# EAGLE design scanner (EAGLE 7.5.0)
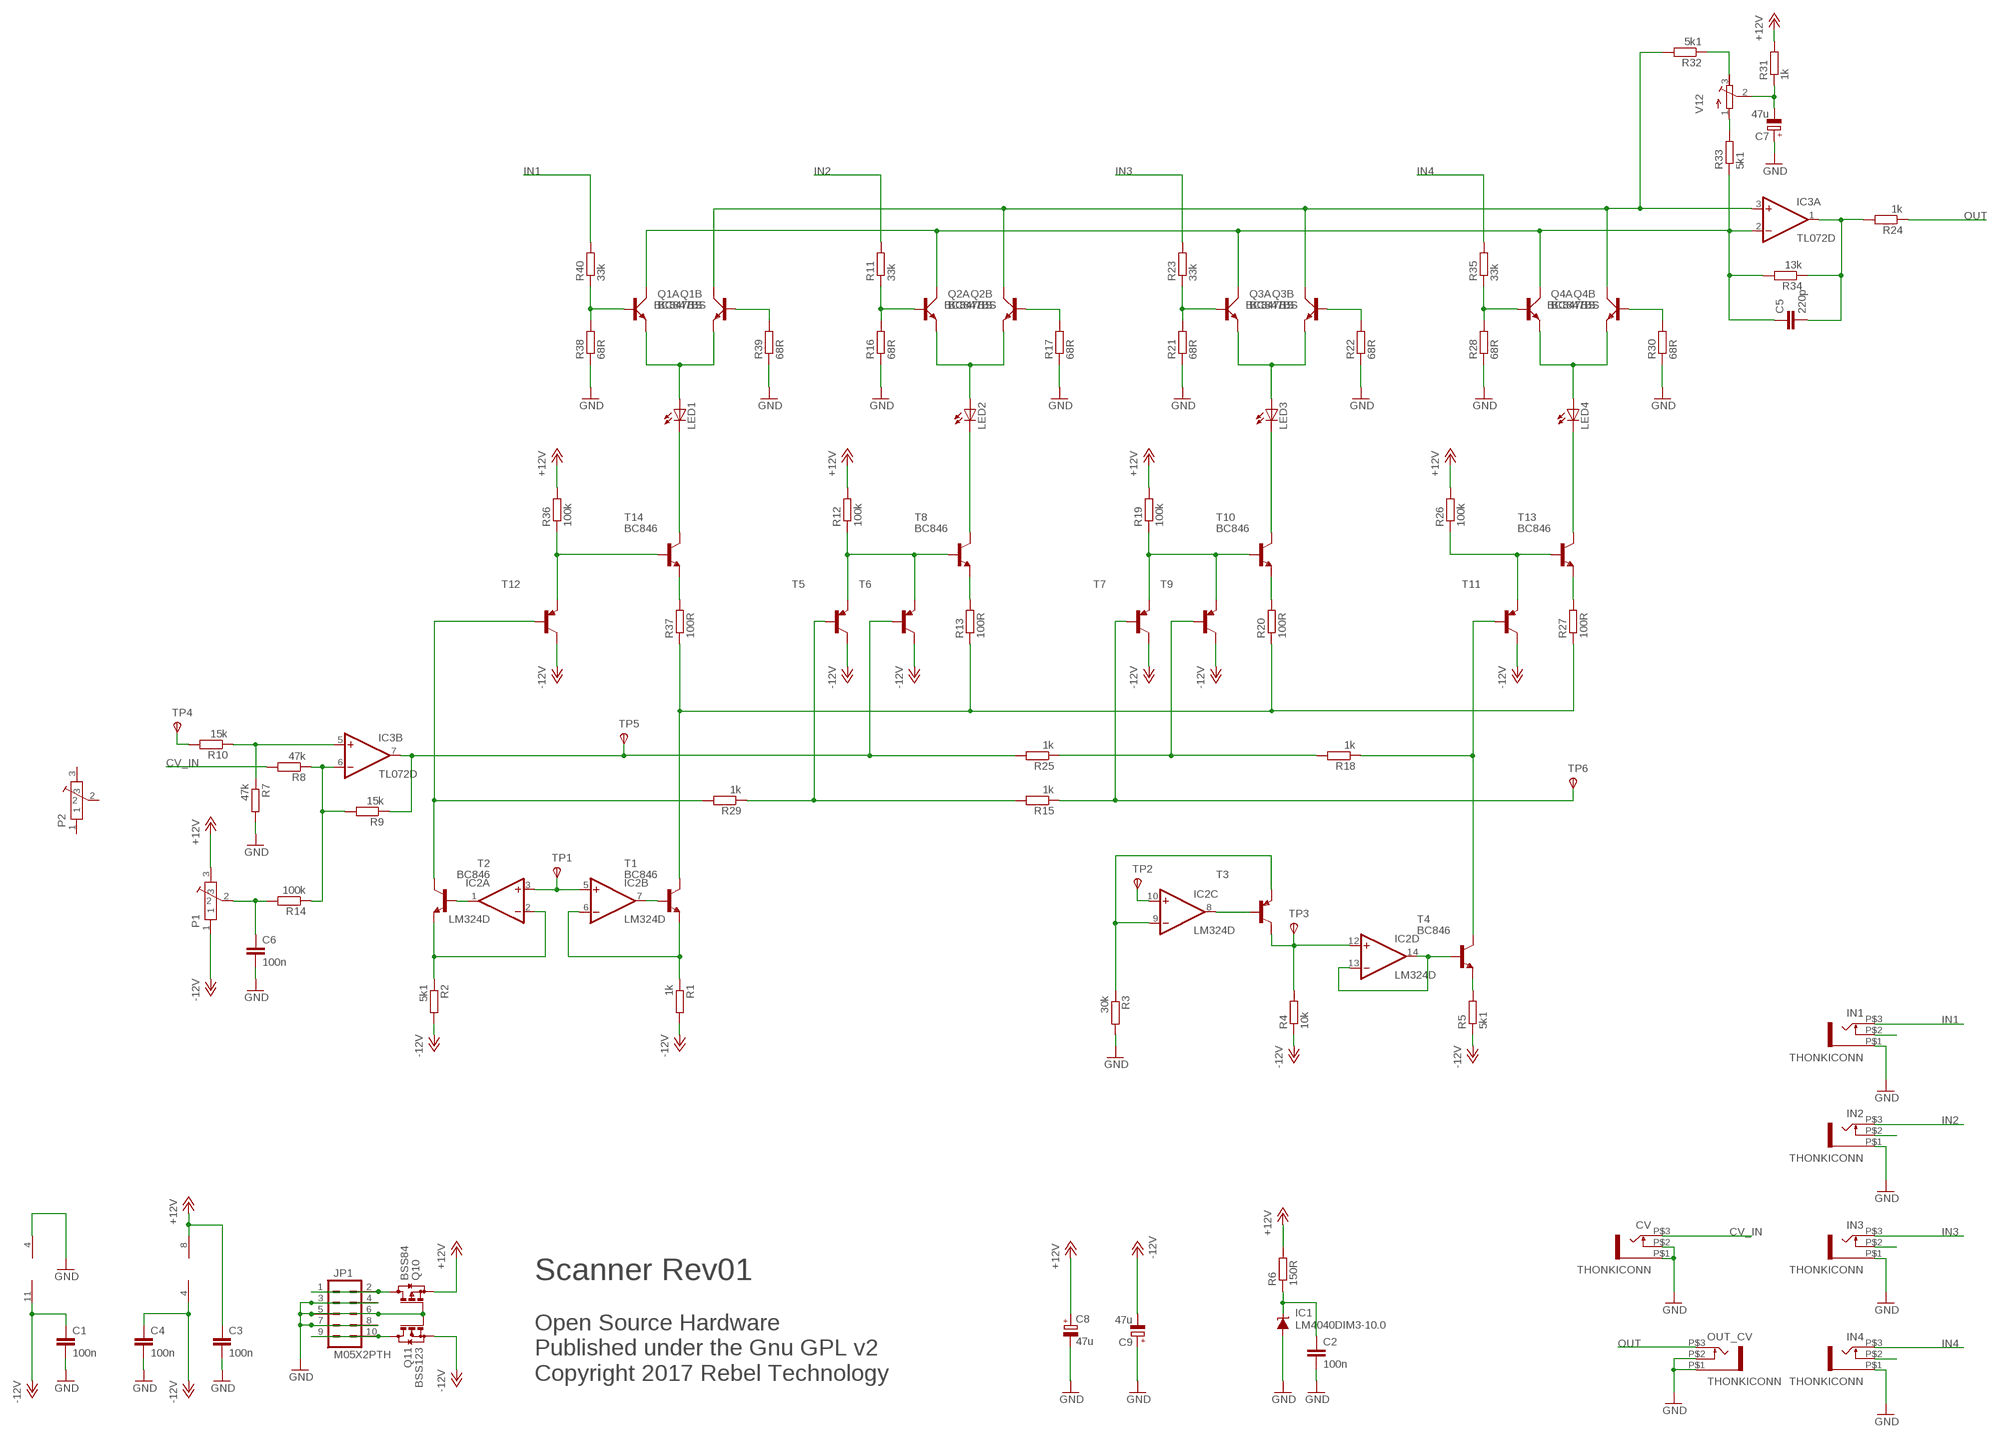
[diagram p0: schematic, sheet 1]

## Parts
C1  100n  C-EUC0603  [C0603]
C2  100n  C-EUC0603  [C0603]
C3  100n  C-EUC0603  [C0603]
C4  100n  C-EUC0603  [C0603]
C5  220p  C-EUC0603  [C0603]
C6  100n  C-EUC0603  [C0603]
C7  47u  CPOL-EU153CLV-0505  [CPOL-5]
C8  47u  CPOL-EU153CLV-0505  [CPOL-5]
C9  47u  CPOL-EU153CLV-0505  [CPOL-5]
CV  THONKICONN  [THONKICONN]
IC1  LM4040DIM3-10.0  LM4041A12DBZ  [DBZ_R-PDSO-G3]
IC2  LM324D  [SO14]
IC3  TL072D  [SO08]
IN1  THONKICONN  [THONKICONN]
IN2  THONKICONN  [THONKICONN]
IN3  THONKICONN  [THONKICONN]
IN4  THONKICONN  [THONKICONN]
JP1  M05X2PTH  [AVR_ICSP]
LED1  LED3MM  [LED3MM]
LED2  LED3MM  [LED3MM]
LED3  LED3MM  [LED3MM]
LED4  LED3MM  [LED3MM]
OUT_CV  THONKICONN  [THONKICONN]
P1  POT-ALPS-RK09L1140  [POT-ALPS-RK09L1140]
P2  POT-ALPS-RK09L1140  [POT-ALPS-RK09L1140]
Q1  BC847BS  [SOT363_PHILIPS]
Q2  BC847BS  [SOT363_PHILIPS]
Q3  BC847BS  [SOT363_PHILIPS]
Q4  BC847BS  [SOT363_PHILIPS]
Q10  BSS84  [SOT23]
Q11  BSS123  [SOT23]
R1  1k  R-EU_0603  [0603]
R2  5k1  R-EU_0603  [0603]
R3  30k  R-EU_0603  [0603]
R4  10k  R-EU_0603  [0603]
R5  5k1  R-EU_0603  [0603]
R6  150R  R-EU_0603  [0603]
R7  47k  R-EU_0603  [0603]
R8  47k  R-EU_0603  [0603]
R9  15k  R-EU_0603  [0603]
R10  15k  R-EU_0603  [0603]
R11  33k  R-EU_0603  [0603]
R12  100k  R-EU_0603  [0603]
R13  100R  R-EU_0603  [0603]
R14  100k  R-EU_0603  [0603]
R15  1k  R-EU_0603  [0603]
R16  68R  R-EU_0603  [0603]
R17  68R  R-EU_0603  [0603]
R18  1k  R-EU_0603  [0603]
R19  100k  R-EU_0603  [0603]
R20  100R  R-EU_0603  [0603]
R21  68R  R-EU_0603  [0603]
R22  68R  R-EU_0603  [0603]
R23  33k  R-EU_0603  [0603]
R24  1k  R-EU_0603  [0603]
R25  1k  R-EU_0603  [0603]
R26  100k  R-EU_0603  [0603]
R27  100R  R-EU_0603  [0603]
R28  68R  R-EU_0603  [0603]
R29  1k  R-EU_0603  [0603]
R30  68R  R-EU_0603  [0603]
R31  1k  R-EU_0603  [0603]
R32  5k1  R-EU_0603  [0603]
R33  5k1  R-EU_0603  [0603]
R34  13k  R-EU_0603  [0603]
R35  33k  R-EU_0603  [0603]
R36  100k  R-EU_0603  [0603]
R37  100R  R-EU_0603  [0603]
R38  68R  R-EU_0603  [0603]
R39  68R  R-EU_0603  [0603]
R40  33k  R-EU_0603  [0603]
T1  BC846  [SOT23]
T2  BC846  [SOT23]
T3  BC856A-PNP-SOT23-BEC  [SOT23-BEC]
T4  BC846  [SOT23]
T5  BC856A-PNP-SOT23-BEC  [SOT23-BEC]
T6  BC856A-PNP-SOT23-BEC  [SOT23-BEC]
T7  BC856A-PNP-SOT23-BEC  [SOT23-BEC]
T8  BC846  [SOT23]
T9  BC856A-PNP-SOT23-BEC  [SOT23-BEC]
T10  BC846  [SOT23]
T11  BC856A-PNP-SOT23-BEC  [SOT23-BEC]
T12  BC856A-PNP-SOT23-BEC  [SOT23-BEC]
T13  BC846  [SOT23]
T14  BC846  [SOT23]
TP1  TPSPAD1-13  [P1-13]
TP2  TPSPAD1-13  [P1-13]
TP3  TPSPAD1-13  [P1-13]
TP4  TPSPAD1-13  [P1-13]
TP5  TPSPAD1-13  [P1-13]
TP6  TPSPAD1-13  [P1-13]
V12  R-TRIMM64W  [RTRIM64W]

## Nets
+12V: C3.1 C8.+ IC3.8(P:V+) P1.3 Q10.2(S) R6.2 R12.2 R19.2 R26.2 R31.2 R36.2
-12V: C1.1 C4.1 C9.- IC2.11(P:V-) IC3.4(P:V-) P1.1 Q11.2(S) R1.2 R2.2 R4.1 R5.1 T5.C T6.C T7.C T9.C T11.C T12.C
CV_IN: CV.P$3 R8.2
GND: C1.2 C2.2 C3.2 C4.2 C6.2 C7.+ C8.- C9.+ CV.P$1 CV.P$2 IC1.2(A) IC2.4(P:V+) IN1.P$1 IN2.P$1 IN3.P$1 IN4.P$1 JP1.3 JP1.4 JP1.5 JP1.6 JP1.7 JP1.8 OUT_CV.P$1 OUT_CV.P$2 Q10.1(G) Q11.1(G) R3.2 R7.2 R16.1 R17.1 R21.1 R22.1 R28.1 R30.1 R38.1 R39.1
IN1: IN1.P$3 R40.2
IN2: IN2.P$3 R11.2
IN3: IN3.P$3 R23.2
IN4: IN4.P$3 R35.2
N$1: IN3.P$2
N$2: IN1.P$2
N$3: IN2.P$2
N$4: JP1.9 JP1.10 Q11.3(D)
N$5: C6.1 P1.2 R14.2
N$6: IN4.P$2
N$7: Q3.2(A:B) R21.2 R23.1
N$8: Q3.5(B:B) R22.2
N$9: LED3.A Q3.1(A:E) Q3.4(B:E)
N$10: R19.1 T7.E T9.E T10.1(B)
N$11: LED3.K(C) T10.3(C)
N$12: R20.2 T10.2(E)
N$13: R18.1 T4.3(C) T11.B
N$15: R15.1 T7.B TP6.TP(PP)
N$17: C5.1 IC3.2(A:-IN) Q1.6(A:C) Q2.6(A:C) Q3.6(A:C) Q4.6(A:C) R33.1 R34.2
N$18: R18.2 R25.1 T9.B
N$20: R13.1 R20.1 R27.1 R37.1 T1.3(C)
N$27: IC2.13(D:-IN) IC2.14(D:OUT) T4.1(B)
N$31: IC2.8(C:OUT) T3.B
N$36: IC2.12(D:+IN) R4.2 T3.C TP3.TP(PP)
N$40: R5.2 T4.2(E)
N$41: IC2.9(C:-IN) R3.1 T3.E
N$42: IC2.10(C:+IN) TP2.TP(PP)
N$47: IC2.1(A:OUT) T2.1(B)
N$51: IC2.7(B:OUT) T1.1(B)
N$53: IC2.3(A:+IN) IC2.5(B:+IN) TP1.TP(PP)
N$58: IC2.6(B:-IN) R1.1 T1.2(E)
N$59: IC2.2(A:-IN) R2.1 T2.2(E)
N$60: IC3.6(B:-IN) R8.1 R9.2 R14.1
N$61: R10.2 TP4.TP(PP)
N$63: IC3.5(B:+IN) R7.1 R10.1
N$79: JP1.1 JP1.2 Q10.3(D)
N$95: C2.1 IC1.1(C) R6.1
N$145: C5.2 IC3.1(A:OUT) R24.2 R34.1
N$147: R33.2 V12.1(A)
N$148: R32.1 V12.3(E)
N$149: C7.- R31.1 V12.2(S)
N$151: Q4.2(A:B) R28.2 R35.1
N$152: Q4.5(B:B) R30.2
N$153: LED4.A Q4.1(A:E) Q4.4(B:E)
N$154: R26.1 T11.E T13.1(B)
N$155: LED4.K(C) T13.3(C)
N$156: R27.2 T13.2(E)
N$158: R29.2 T2.3(C) T12.B
N$159: IC3.7(B:OUT) R9.1 R25.2 T6.B TP5.TP(PP)
N$167: Q2.2(A:B) R11.1 R16.2
N$168: Q2.5(B:B) R17.2
N$169: LED2.A Q2.1(A:E) Q2.4(B:E)
N$170: R12.1 T5.E T6.E T8.1(B)
N$171: LED2.K(C) T8.3(C)
N$172: R13.2 T8.2(E)
N$182: IC3.3(A:+IN) Q1.3(B:C) Q2.3(B:C) Q3.3(B:C) Q4.3(B:C) R32.2
N$183: Q1.2(A:B) R38.2 R40.1
N$184: Q1.5(B:B) R39.2
N$185: LED1.A Q1.1(A:E) Q1.4(B:E)
N$186: R36.1 T12.E T14.1(B)
N$187: LED1.K(C) T14.3(C)
N$188: R37.2 T14.2(E)
N$191: R15.2 R29.1 T5.B
OUT: OUT_CV.P$3 R24.1
Unconnected: P1.P$5 P1.P$6 P2.1 P2.2 P2.3 P2.P$5 P2.P$6

## Notes on the sheet
- Scanner Rev01
- Open Source Hardware
  Published under the Gnu GPL v2
  Copyright 2017 Rebel Technology

## Library data of the parts
C1-C6 = Rebel:C-EU: CAPACITOR, European symbol
C7-C9 = Rebel:CPOL-EU: POLARIZED CAPACITOR, European symbol
CV IN1-IN4 OUT_CV = Rebel:THONKICONN
IC1 = texas:LM4041: PRECISION MICROPOWER SHUNT VOLTAGE REFERENCE Source: http://focus.ti.com/lit/ds/slcs146e/slcs146e.pdf; MPN: LM4041A12IDBZR; OC_FARNELL: 1407949; OC_NEWARK: 58K5875
IC2 = linear:LM324: OP AMP
IC3 = linear:TL072: OP AMP
JP1 = SparkFun:M05X2: Header 5x2 Standard 10-pin dual row 0.1" header. Commonly used with AVR-ISP. Use with Spark Fun Electronics SKU: PRT-00778
LED1-LED4 = Rebel:LED: LED
P1 P2 = Rebel:POT-ALPS-RK09L
Q1-Q4 = transistor-small-signal:BC847BS: NPN general purpose double transistor Source: http://www.farnell.com/datasheets/2466.pdf
Q10 = transistor-small-signal:BSS84: P-CHANNEL MOS FET; OC_FARNELL: 1779264
Q11 = transistor-small-signal:BSS123: N-CHANNEL MOS FET; OC_FARNELL: 1843725
R1-R40 = Rebel:R-EU_: RESISTOR, European symbol
T1 T2 T4 T8 T10 T13 T14 = transistor:BC846: NPN TRANSISTOR
T3 T5-T7 T9 T11 T12 = transistor:*-PNP-: PNP Transistror
TP1-TP6 = testpad:TPS: TEST PIN
V12 = resistor:R-TRIMM: Trimm resistor

## Module TRIGGER
Ports: TR_IN(io)

### Library data of the parts

## Board
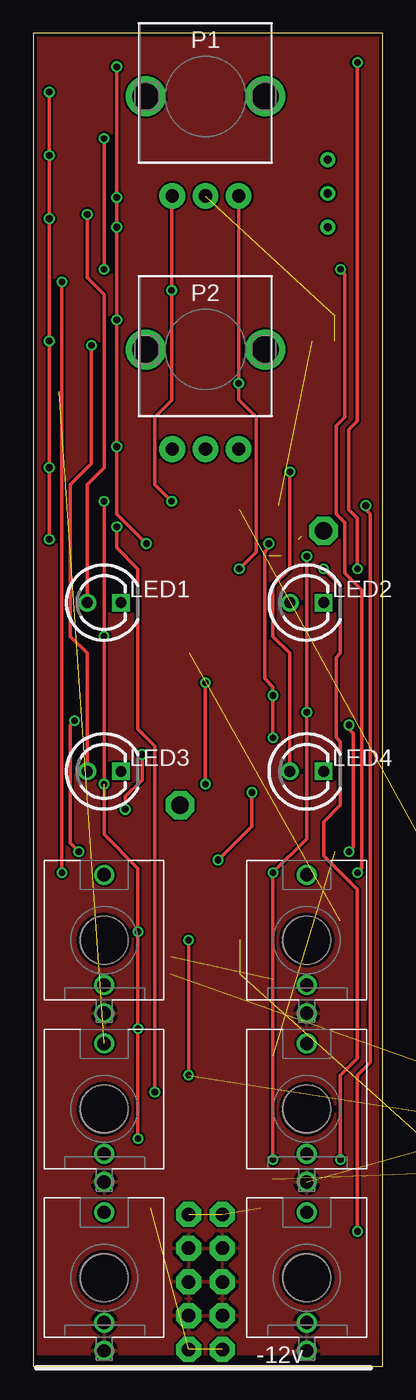
[diagram p1: board, top side]
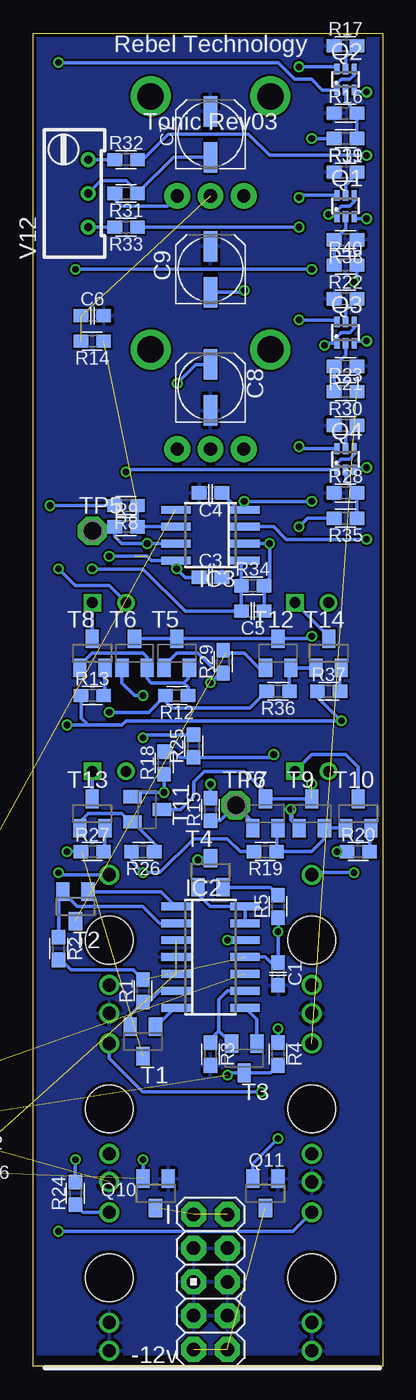
[diagram p2: board, bottom side, seen from below]

Size 26.29 x 100.32 mm. Coordinates in mm from the lower left corner, seen from the top.
Outline: 26.29,0 26.29,100.32 0,100.32 0,0 26.29,0
Copper layers (1*16): Top 0.035mm / dielectric 1.5mm / Bottom 0.035mm
Design rules "SeeedStudio_2layer_DRU_no_angle_20140221": minimum track width 6mil, minimum drill 12mil, track to track 6mil, track to pad 6mil, pad to pad 6mil, via to via 6mil, smd to smd 0mil, copper to edge 10mil, drill to drill 10mil, minimum pad ring 10mil, minimum via ring 6mil, stop-mask expansion 2mil, vias tented up to drill 100mil, thermal gap 10mil

### Footprints (pad centres in the part's own frame; a part is rotated, then mirrored left to right if it is on the bottom)
C0603 = smd 1.1 x 1: 1 -0.85,0; 2 0.85,0
CPOL-5 = smd 2.3 x 1: + 1.725,0; - -1.725,0
THONKICONN = drill 1: P$1 0,-5.5; P$2 0,-3.38; P$3 0,4.92 | hole 3.6: 0,0
DBZ_R-PDSO-G3 = smd 0.7 x 1: 1 -0.95,-1.1; 2 0.95,-1.1; 3 0,1.1
SO14 = smd 0.6 x 2.2: 1 -3.81,-2.6; 2 -2.54,-2.6; 3 -1.27,-2.6; 4 0,-2.6; 5 1.27,-2.6; 6 2.54,-2.6; 7 3.81,-2.6; 8 3.81,2.6; 9 2.54,2.6; 10 1.27,2.6; 11 0,2.6; 12 -1.27,2.6; 13 -2.54,2.6; 14 -3.81,2.6
SO08 = smd 0.6 x 2.2: 1 -1.905,-2.6; 2 -0.635,-2.6; 3 0.635,-2.6; 4 1.905,-2.6; 5 1.905,2.6; 6 0.635,2.6; 7 -0.635,2.6; 8 -1.905,2.6
AVR_ICSP = drill 1.016 pad 1.88 octagon: 1 -1.27,5.08; 2 1.27,5.08; 3 -1.27,2.54; 4 1.27,2.54; 5 -1.27,0; 6 1.27,0; 7 -1.27,-2.54; 8 1.27,-2.54; 9 -1.27,-5.08; 10 1.27,-5.08
LED3MM = drill 0.813: A -1.27,0 | drill 0.813 square: K 1.27,0
POT-ALPS-RK09L1140 = drill 1 pad 1.93: 1 -2.5,-7.5; 2 0,-7.5; 3 2.5,-7.5 | drill 2: P$5 -4.5,0; P$6 4.5,0
SOT363_PHILIPS = smd 0.4 x 0.8: 1 -0.65,-0.8; 2 0,-0.8; 3 0.65,-0.8; 4 0.65,0.8; 5 0,0.8; 6 -0.65,0.8
SOT23 = smd 1 x 1.4: 1 -0.95,-1.1; 2 0.95,-1.1; 3 0,1.1
0603 = smd 1.1 x 1: 1 -0.85,0; 2 0.85,0
SOT23-BEC = smd 1 x 1.4: B -0.95,-1.1; C 0,1.1; E 0.95,-1.1
P1-13 = drill 1.321 pad 2.159 octagon: TP 0,0
RTRIM64W = drill 0.61: 1 1.27,-2.54; 2 1.27,0; 3 1.27,2.54

### Placement (x,y rotation side)
C1  7.87,29.53 270 bottom
C2  32,16.83 0 bottom  (outside the outline)
C3  12.95,59.37 0 bottom
C4  12.95,65.72 180 bottom
C5  9.78,56.83 180 bottom
C6  21.84,79.06 0 bottom
C7  12.95,92.71 90 bottom
C8  12.95,73.66 90 bottom
C9  12.95,82.55 90 bottom
CV  5.33,6.67 0 top
IC1  32,20.64 0 bottom  (outside the outline)
IC2  12.95,30.8 270 bottom
IC3  12.95,62.55 90 bottom
IN1  5.33,32.07 0 top
IN2  20.57,32.07 0 top
IN3  5.33,19.37 0 top
IN4  20.57,19.37 0 top
JP1  12.95,6.35 0 bottom
LED1  5.33,57.47 0 top
LED2  20.57,57.47 0 top
LED3  5.33,44.77 0 top
LED4  20.57,44.77 0 top
OUT_CV  20.57,6.67 0 top
P1  12.95,95.57 0 top
P2  12.95,76.52 0 top
Q1  2.79,87.31 0 bottom
Q2  2.79,96.84 0 bottom
Q3  2.79,77.79 0 bottom
Q4  2.79,68.26 0 bottom
Q10  17.08,13.02 180 bottom
Q11  8.83,13.02 180 bottom
R1  18.03,28.26 90 bottom
R2  24.38,31.43 270 bottom
R3  12.95,23.49 270 bottom
R4  7.87,23.49 270 bottom
R5  7.87,34.61 90 bottom
R6  32,14.61 0 bottom  (outside the outline)
R7  42.16,16.83 90 bottom  (outside the outline)
R8  19.3,64.77 180 bottom
R9  19.3,63.18 0 bottom
R10  49.78,16.83 90 bottom  (outside the outline)
R11  2.79,92.39 180 bottom
R12  15.49,50.48 180 bottom
R13  21.84,50.48 0 bottom
R14  21.84,77.15 180 bottom
R15  12.95,41.91 90 bottom
R16  2.79,94.3 0 bottom
R17  2.79,99.38 0 bottom
R18  16.45,45.4 90 bottom
R19  8.83,38.73 180 bottom
R20  1.84,38.73 0 bottom
R21  2.79,75.25 180 bottom
R22  2.79,80.33 0 bottom
R23  2.79,73.34 0 bottom
R24  23.11,13.02 90 bottom
R25  14.22,46.67 90 bottom
R26  18.03,38.73 180 bottom
R27  21.84,38.73 0 bottom
R28  2.79,65.72 0 bottom
R29  12,53.02 90 bottom
R30  2.79,70.8 0 bottom
R31  19.3,88.27 180 bottom
R32  19.3,90.8 0 bottom
R33  19.3,85.72 180 bottom
R34  9.78,58.74 0 bottom
R35  2.79,63.82 180 bottom
R36  7.87,50.8 180 bottom
R37  4.06,50.8 0 bottom
R38  2.79,84.77 180 bottom
R39  2.79,89.85 0 bottom
R40  2.79,82.87 0 bottom
T1  18.03,24.45 180 bottom
T2  23.11,34.61 180 bottom
T3  10.41,23.18 180 bottom
T4  12.95,37.15 0 bottom
T5  15.49,53.66 0 bottom
T6  18.67,53.66 0 bottom
T7  8.83,41.59 0 bottom
T8  21.84,53.66 0 bottom
T9  5.33,41.59 0 bottom
T10  1.84,41.59 0 bottom
T11  17.72,41.91 270 bottom
T12  7.87,53.66 0 bottom
T13  21.84,41.59 0 bottom
T14  4.06,53.66 0 bottom
TP1  39.62,7.94 90 bottom  (outside the outline)
TP2  71.37,7.94 90 bottom  (outside the outline)
TP3  100.58,7.94 90 bottom  (outside the outline)
TP4  42.16,20.64 90 bottom  (outside the outline)
TP5  21.84,62.87 0 bottom
TP6  11.05,42.23 0 bottom
V12  23.43,88.27 0 bottom

### Tracks (layer width: path | path; a pad name or v marks a point on that pad's centre or on a via)
+12V  (via drill 0.5)  (3 unrouted)
  Top 0.254: 15.49,88.03 P1.3 v15.45,73.98 15.45,72.75 16.76,71.44 16.76,61.28 v15.49,60.01 | v18.03,15.56 v18.03,37.15 20.57,39.69 v20.57,49.21 v20.57,60.96
  Bottom 0.254: IC3.8 15.55,60.07 v15.49,60.01 | R31.2 20.15,87.85 19.62,87.31 16.21,87.31 P1.3 | C8.+ 14.05,75.38 v15.45,73.98 | Q10.2 v18.03,15.56 | v20.57,49.21 17.61,49.21 R12.2 16.34,50.06 15.81,49.53 9.99,49.53 R36.2 | 9.68,38.52 R19.2 10.73,38.73 11.68,39.69 14.22,39.69 16.76,37.15 v18.03,37.15 18.88,38 R26.2 | C3.1 14.86,59.37 v15.49,60.01 | v20.57,60.96 17.72,60.96 17.4,60.64 16.13,60.64 v15.49,60.01
-12V  (via drill 0.5)  (2 unrouted)
  Top 0.254: v10.41,65.09 9.14,66.36 9.14,71.44 10.41,72.71 v10.41,80.96 10.41,88.03 P1.1 | v7.87,17.15 v7.87,25.4 v7.87,32.7 7.87,37.47 5.33,40.01 v5.33,43.82 v5.33,54.93 v5.33,65.09
  Bottom 0.254: C9.- 10.55,80.82 v10.41,80.96 | R4.1 v7.87,25.4 | IC2.11 8.83,30.8 8.41,30.38 C1.1 v7.87,32.7 R5.1 | Q11.2 9.78,15.24 v7.87,17.15 | v5.33,65.09 v10.41,65.09 10.35,65.03 IC3.4 10.83,64.45 C4.1 | R2.2 24.17,30.58 23.43,29.84 18.77,29.84 R1.2 | v5.33,54.93 5.5,54.76 T12.C T5.C T6.C | T9.C T7.C 8.83,43.18 10.41,44.77 13.42,44.77 14.22,43.96 14.22,42.86 15.18,41.91 T11.C
CV_IN  (via drill 0.5)
  Top 0.254: v25.02,64.77 25.02,64.45 25.34,64.14 25.34,22.86 24.38,21.91 v24.38,10.16
  Bottom 0.254: R8.2 v25.02,64.77 | v24.38,10.16 6.76,10.16 CV.P$3
GND  (2 unrouted)
  pour Bottom: -2.29,0.95 30.73,0.95 30.73,101.28 -2.29,101.28
  pour Top: -3.56,0.95 29.46,0.95 29.46,101.28 -3.56,101.28
IN1  (via drill 0.5)
  Top 0.254: v2.16,81.6 v2.16,37.15
  Bottom 0.254: R40.2 1.94,81.81 v2.16,81.6 | v2.16,37.15 5.17,37.15 IN1.P$3
IN2  (via drill 0.5)
  Top 0.254: v24.38,37.15 24.7,37.47 24.7,58.42 23.43,59.69 23.43,63.5 22.8,64.14 22.8,70.8 23.43,71.44 23.43,82.23 v23.11,82.55 | v5.33,82.55 v5.33,92.39
  Bottom 0.254: IN2.P$3 24.22,36.99 v24.38,37.15 | v23.11,82.55 v5.33,82.55 | v5.33,92.39 R11.2
IN3  (1 unrouted)
IN4  (via drill 0.5)
  Top 0.254: v6.29,63.18 6.29,61.6 7.87,60.01 7.87,47.94 9.14,46.67 v9.14,20.64
  Bottom 0.254: R35.2 5.65,63.82 v6.29,63.18 | v9.14,20.64 18.03,20.64 20.57,23.18 IN4.P$3
N$4  (2 unrouted)
N$5  (2 unrouted)
N$7
  Bottom 0.254: Q3.2 2.79,76.1 R21.2 R23.1
N$8
  Bottom 0.254: Q3.5 2.79,79.48 R22.2
N$9  (via drill 0.5)
  Top 0.254: LED3.A 4.06,53.66 2.79,54.93 2.79,66.36 4.38,67.94 v4.38,76.83
  Bottom 0.254: Q3.4 2.14,78.12 2.48,77.79 3.11,77.79 3.44,77.46 Q3.1 4.23,76.99 v4.38,76.83
N$10
  Bottom 0.254: T7.E 7.98,40.39 R19.1 5.33,38.73 4.38,39.68 T9.E T10.1
N$11
  Bottom 0.254: T10.3 1.84,45.08 2.79,46.04 5.33,46.04 LED3.K
N$12
  Bottom 0.254: R20.2 0.99,40.39 T10.2
N$13  (via drill 0.5)
  Top 0.254: v16.45,43.18 16.45,40.64 v13.91,38.1
  Bottom 0.254: T4.3 13.76,38.25 v13.91,38.1 | T11.B 18.5,43.18 v16.45,43.18 R18.1
N$15
  Bottom 0.254: T7.B 9.78,40.96 TP6.TP 12.22,41.06 R15.1
N$17  (via drill 0.5)
  Top 0.254: v6.29,97.79 v6.29,87.95 v6.29,85.72 v6.29,78.74 v6.29,69.21 6.29,64.14 v8.51,61.91
  Bottom 0.254: IC3.2 v8.51,61.91 8.51,59.37 8.93,58.95 R34.2 C5.1 | R33.1 v6.29,85.72 | v6.29,97.79 3.6,97.79 Q2.6 | v6.29,78.74 3.6,78.74 Q3.6 | Q1.6 6.12,88.11 v6.29,87.95 | Q4.6 6.13,69.06 v6.29,69.21
N$18  (via drill 0.5)
  Top 0.254: v6.92,41.91 6.92,42.86 8.19,44.13 v8.19,46.04
  Bottom 0.254: v6.92,41.91 6.92,41.13 T9.B | R18.2 15.71,46.25 15.28,45.82 R25.1 8.41,45.82 v8.19,46.04
N$20  (via drill 0.5)  (1 unrouted)
  Top 0.254: v3.11,48.58 2.79,48.26 2.79,39.37 v3.43,38.73 | v23.75,48.26 23.75,47.94 24.07,47.62 24.07,39.05 v23.75,38.73
  Bottom 0.254: v3.43,38.73 R20.1 | R13.1 22.69,48.79 22.16,48.26 | 22.16,48.26 19.62,48.26 19.3,48.58 v3.11,48.58 4.91,50.38 R37.1 | 22.16,48.26 v23.75,48.26 | v23.75,38.73 R27.1
N$27
  Bottom 0.254: IC2.13 IC2.14 12.95,34.61 13.9,35.56 T4.1
N$31
  Bottom 0.254: T3.B 9.46,26.1 IC2.8
N$36  (via drill 0.5)  (1 unrouted)
  Top 0.254: v11.68,21.91 v11.68,32.07
  Bottom 0.254: R4.2 8.44,22.08 T3.C 11.51,22.08 v11.68,21.91 | v11.68,32.07 IC2.12
N$40
  Bottom 0.254: T4.2 8.46,36.05 R5.2
N$41
  Bottom 0.254: IC2.9 11.68,28.26 12.32,27.62 12.32,25.23 | 12.32,25.23 T3.E | R3.1 12.95,24.6 12.32,25.23
N$42  (1 unrouted)
N$47
  Bottom 0.254: T2.1 16.65,35.71 IC2.1
N$51
  Bottom 0.254: IC2.7 15.64,26.99 T1.1
N$53  (2 unrouted)
N$58
  Bottom 0.254: IC2.6 16.76,28.26 17.61,27.41 R1.1 18.98,26.46 T1.2
N$59
  Bottom 0.254: R2.1 24.38,35.39 T2.2 22.96,34.61 18.03,34.61 16.76,33.34 IC2.2
N$60  (1 unrouted)
  Bottom 0.254: IC3.6 R9.2 R8.1
N$61  (1 unrouted)
N$63  (2 unrouted)
N$79  (2 unrouted)
N$95  (2 unrouted)
N$145  (via drill 0.5)  (1 unrouted)
  Top 0.254: v23.11,15.56 23.11,21.91 24.38,23.18 24.38,35.88 21.84,38.42 21.84,40.96 23.11,42.23 23.11,46.99 22.8,47.31 22.8,53.34 23.11,53.66 23.11,58.74 v21.84,60.01
  Bottom 0.254: IC3.1 10.63,60.37 R34.1 C5.2 14.86,56.83 18.03,60.01 v21.84,60.01 | R24.2 v23.11,15.56
N$147
  Bottom 0.254: V12.1 R33.2
N$148
  Bottom 0.254: V12.3 R32.1
N$149
  Bottom 0.254: C7.- 15.73,90.99 R31.1 18.45,88.37 19.3,89.22 21.21,89.22 V12.2
N$151
  Bottom 0.254: R35.1 R28.2 2.79,66.57 Q4.2
N$152
  Bottom 0.254: Q4.5 2.79,69.95 R30.2
N$153  (via drill 0.5)
  Top 0.254: v19.3,67.31 19.3,60.01 18.03,58.74 18.03,54.93 19.3,53.66 LED4.A
  Bottom 0.254: Q4.4 2.14,68.6 2.48,68.26 3.11,68.26 3.44,67.93 Q4.1 19.15,67.46 v19.3,67.31
N$154
  Bottom 0.254: R26.1 17.08,38.83 17.08,39.23 T11.E 18.99,40.96 19.62,41.59 22.16,41.59 22.79,40.96 T13.1
N$155
  Bottom 0.254: T13.3 LED4.K
N$156
  Bottom 0.254: T13.2 20.89,38.83 R27.2
N$158  (1 unrouted)
  Bottom 0.254: T2.3 23.11,33.34 | T12.B 9.31,52.56 10.41,53.66 11.79,53.66 R29.2
N$159  (via drill 0.5)  (2 unrouted)
  Top 0.254: v18.03,47.31 v18.03,50.48 18.03,51.12 17.4,51.75 17.4,61.28 17.72,61.6 v17.72,61.91
  Bottom 0.254: T6.B 19.62,51.43 18.67,50.48 v18.03,50.48 | IC3.7 v17.72,61.91 19.62,61.91 20.15,62.44 R9.1 21.53,63.18 TP5.TP | R25.2 17.82,47.52 v18.03,47.31
N$167
  Bottom 0.254: Q2.2 2.79,95.15 R16.2 R11.1
N$168
  Bottom 0.254: Q2.5 2.79,98.53 R17.2
N$169  (via drill 0.5)
  Top 0.254: v24.38,98.11 24.38,71.12 23.75,70.49 23.75,64.45 24.38,63.82 v24.38,60.01
  Bottom 0.254: Q2.4 2.14,97.17 2.48,96.84 3.11,96.84 3.44,96.51 Q2.1 4.53,96.04 5.33,96.84 6.6,96.84 7.87,98.11 v24.38,98.11 | v24.38,60.01 23.11,58.74 20.57,58.74 LED2.A
N$170
  Bottom 0.254: R12.1 14.64,51.12 14.96,51.43 | T5.E 14.64,52.46 14.64,51.75 14.96,51.43 | T8.1 22.79,52.71 21.84,53.66 18.03,53.66 17.72,53.34 T6.E 17.72,51.76 17.4,51.43 14.96,51.43
N$171
  Bottom 0.254: T8.3 LED2.K
N$172
  Bottom 0.254: T8.2 20.89,50.9 R13.2
N$182  (via drill 0.5)
  Top 0.254: v1.21,95.88 v1.21,91.12 v1.21,86.36 v1.21,77.15 v1.21,67.63 v1.21,62.23
  Bottom 0.254: R32.2 18.03,90.8 16.13,92.71 10.1,92.71 8.51,91.12 v1.21,91.12 | v1.21,86.36 1.99,86.36 Q1.3 | v1.21,95.88 1.99,95.88 Q2.3 | v1.21,62.23 7.24,62.23 8.19,63.18 IC3.3 | v1.21,67.63 1.98,67.63 Q4.3 | v1.21,77.15 1.98,77.15 Q3.3
N$183
  Bottom 0.254: Q1.2 2.79,85.62 R38.2 R40.1
N$184
  Bottom 0.254: Q1.5 2.79,88.9 2.16,89.54 2.16,89.85 R39.2
N$185  (via drill 0.5)
  Top 0.254: LED1.A 4.06,66.36 5.33,67.63 5.33,80.65 4.06,81.91 v4.06,86.68
  Bottom 0.254: Q1.4 2.14,87.65 2.48,87.31 3.11,87.31 3.44,86.98 Q1.1 3.61,86.68 v4.06,86.68
N$186
  Bottom 0.254: T14.1 T12.E 7.02,52.46 R36.1
N$187
  Bottom 0.254: T14.3 4.06,54.93 LED1.K
N$188
  Bottom 0.254: R37.2 3.21,52.46 T14.2
N$191  (via drill 0.5)
  Top 0.254: v12.95,51.43 v12.95,43.82
  Bottom 0.254: T5.B 16.44,52.71 15.49,53.66 13.91,53.66 12.64,52.39 12.22,52.39 R29.1 12.22,52.17 v12.95,51.43 | R15.2 v12.95,43.82
OUT
  Bottom 0.254: OUT_CV.P$3 22.53,11.59 R24.1

### Text on the board
tPlace: -12v
bPlace: Rebel Technology | Tonic Rev03 | -12v